# Altium schematic sheet RF.SchDoc
size 393 x 281 mm; DocumentNumber: 5; SheetNumber: 5; SheetTotal: 11
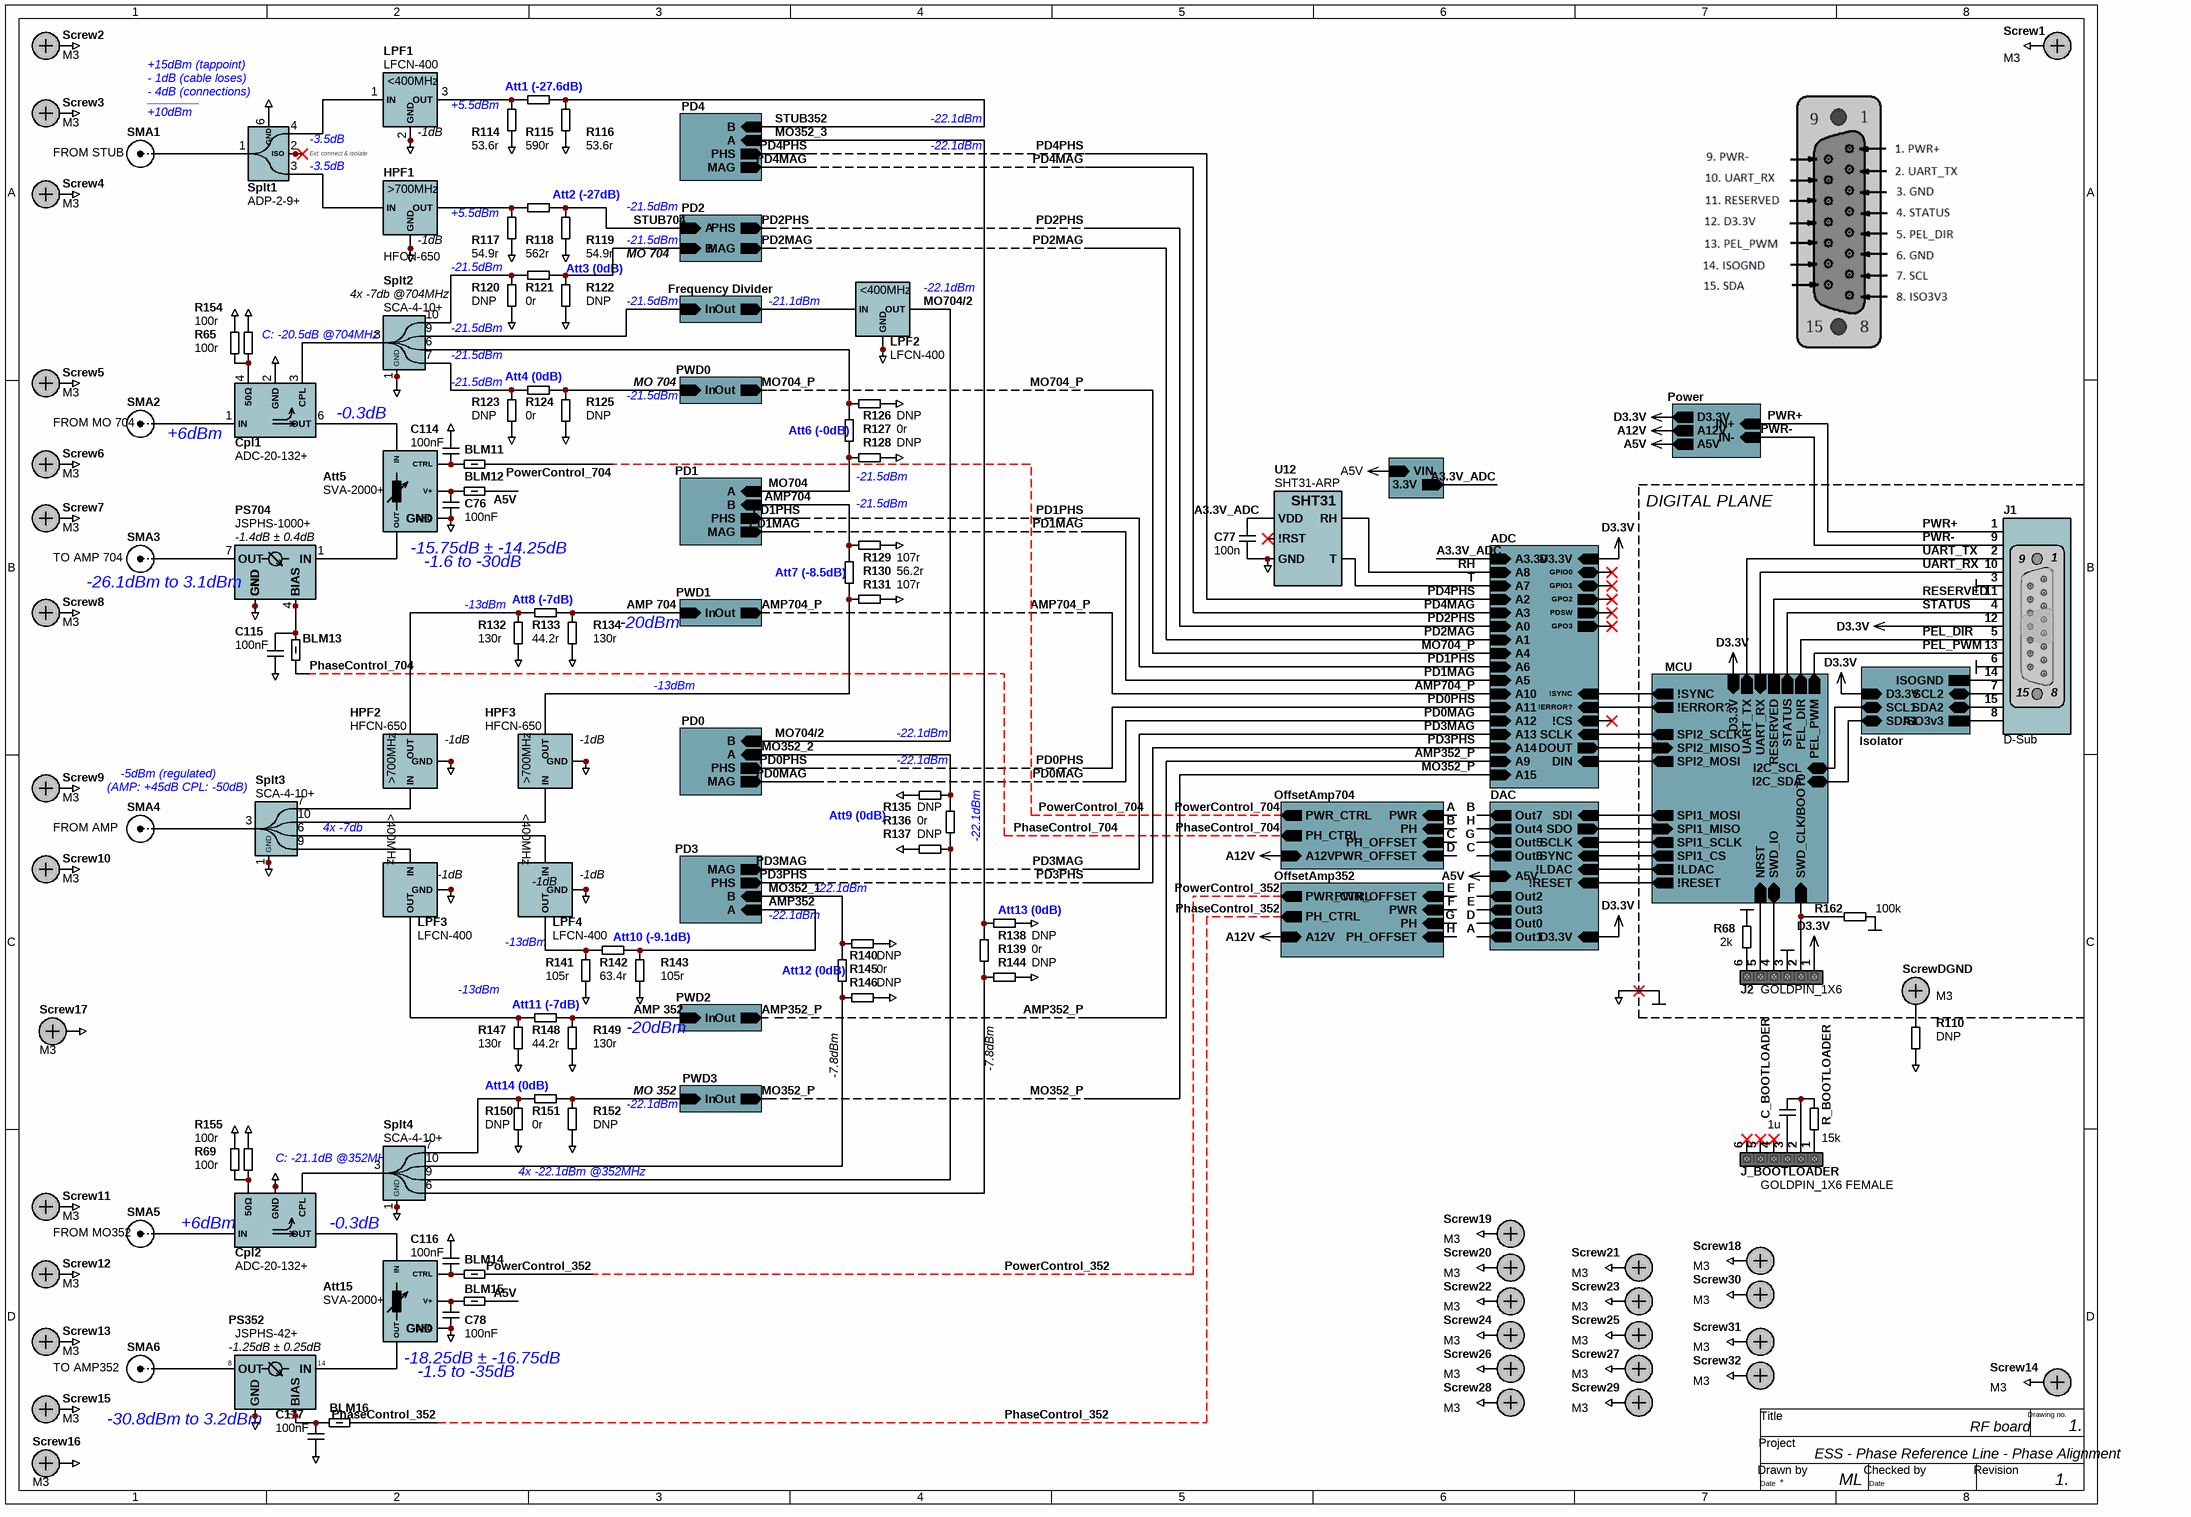
[diagram p0: RF.SchDoc]

## Parts
Att5  SVA-2000+  [FZ990]
Att15  SVA-2000+  [FZ990]
BLM11  120 Ohms @ 100MHz  [0402-Inductor]  (value not drawn)
BLM12  120 Ohms @ 100MHz  [0402-Inductor]  (value not drawn)
BLM13  120 Ohms @ 100MHz  [0402-Inductor]  (value not drawn)
BLM14  120 Ohms @ 100MHz  [0402-Inductor]  (value not drawn)
BLM15  120 Ohms @ 100MHz  [0402-Inductor]  (value not drawn)
BLM16  120 Ohms @ 100MHz  [0402-Inductor]  (value not drawn)
C76  100nF  [0603-Capacitor]
C77  100n  [0402-Capacitor]
C78  100nF  [0603-Capacitor]
C114  100nF  [0603-Capacitor]
C115  100nF  [0603-Capacitor]
C116  100nF  [0603-Capacitor]
C117  100nF  [0603-Capacitor]
C_BOOTLOADER  1u  [0603-Capacitor]  (no BOM)
Cpl1  ADC-20-132+  [CD542]
Cpl2  ADC-20-132+  [CD542]
HPF1  HFCN-650  [FV1206]
HPF2  HFCN-650  [FV1206]
HPF3  HFCN-650  [FV1206]
J1  D-Sub  [AE10105-ND]
J2  GOLDPIN_1X6  [HDR_1x6 SMD]
J_BOOTLOADER  GOLDPIN_1X6 FEMALE  [HDR_1x6 SMD]  (no BOM)
LPF1  LFCN-400  [FV1206]
LPF2  LFCN-400  [FV1206]
LPF3  LFCN-400  [FV1206]
LPF4  LFCN-400  [FV1206]
PS352  JSPHS-42+  [BK276]
PS704  JSPHS-1000+  [BK276]
R65  100r  [0402-RESISTOR]
R68  2k  [0402-RESISTOR]
R69  100r  [0402-RESISTOR]
R110  DNP  [0402-RESISTOR]  (no BOM)
R114  53.6r  [0603-RESISTOR]
R115  590r  [0603-RESISTOR]
R116  53.6r  [0603-RESISTOR]
R117  54.9r  [0603-RESISTOR]
R118  562r  [0603-RESISTOR]
R119  54.9r  [0603-RESISTOR]
R120  DNP  [0603-RESISTOR]  (no BOM)
R121  0r  [0603-RESISTOR]
R122  DNP  [0603-RESISTOR]  (no BOM)
R123  DNP  [0603-RESISTOR]  (no BOM)
R124  0r  [0603-RESISTOR]
R125  DNP  [0603-RESISTOR]  (no BOM)
R126  DNP  [0603-RESISTOR]  (no BOM)
R127  0r  [0603-RESISTOR]
R128  DNP  [0603-RESISTOR]  (no BOM)
R129  107r  [0603-RESISTOR]
R130  56.2r  [0603-RESISTOR]
R131  107r  [0603-RESISTOR]
R132  130r  [0603-RESISTOR]
R133  44.2r  [0603-RESISTOR]
R134  130r  [0603-RESISTOR]
R135  DNP  [0603-RESISTOR]  (no BOM)
R136  0r  [0603-RESISTOR]
R137  DNP  [0603-RESISTOR]  (no BOM)
R138  DNP  [0603-RESISTOR]  (no BOM)
R139  0r  [0603-RESISTOR]
R140  DNP  [0603-RESISTOR]  (no BOM)
R141  105r  [0603-RESISTOR]
R142  63.4r  [0603-RESISTOR]
R143  105r  [0603-RESISTOR]
R144  DNP  [0603-RESISTOR]  (no BOM)
R145  0r  [0603-RESISTOR]
R146  DNP  [0603-RESISTOR]  (no BOM)
R147  130r  [0603-RESISTOR]
R148  44.2r  [0603-RESISTOR]
R149  130r  [0603-RESISTOR]
R150  DNP  [0603-RESISTOR]  (no BOM)
R151  0r  [0603-RESISTOR]
R152  DNP  [0603-RESISTOR]  (no BOM)
R154  100r  [0402-RESISTOR]
R155  100r  [0402-RESISTOR]
R162  100k  [0402-RESISTOR]
R_BOOTLOADER  15k  [0603-RESISTOR]  (no BOM)
Screw1  M3  [M3 Screw]
Screw2  M3  [M3 Screw]
Screw3  M3  [M3 Screw]
Screw4  M3  [M3 Screw]
Screw5  M3  [M3 Screw]
Screw6  M3  [M3 Screw]
Screw7  M3  [M3 Screw]
Screw8  M3  [M3 Screw]
Screw9  M3  [M3 Screw]
Screw10  M3  [M3 Screw]
Screw11  M3  [M3 Screw]
Screw12  M3  [M3 Screw]
Screw13  M3  [M3 Screw]
Screw14  M3  [M3 Screw]
Screw15  M3  [M3 Screw]
Screw16  M3  [M3 Screw]
Screw17  M3  [M3 Screw]
Screw18  M3  [M3 Screw]
Screw19  M3  [M3 Screw]
Screw20  M3  [M3 Screw]
Screw21  M3  [M3 Screw]
Screw22  M3  [M3 Screw]
Screw23  M3  [M3 Screw]
Screw24  M3  [M3 Screw]
Screw25  M3  [M3 Screw]
Screw26  M3  [M3 Screw]
Screw27  M3  [M3 Screw]
Screw28  M3  [M3 Screw]
Screw29  M3  [M3 Screw]
Screw30  M3  [M3 Screw]
Screw31  M3  [M3 Screw]
Screw32  M3  [M3 Screw]
ScrewDGND  M3  [M3 Screw]
SMA1  FROM STUB  [MC000242]
SMA2  FROM MO 704  [MC000242]
SMA3  TO AMP 704  [MC000242]
SMA4  FROM AMP  [MC000242]
SMA5  FROM MO352  [MC000242]
SMA6  TO AMP352  [MC000242]
Splt1  ADP-2-9+  [CD636]
Splt2  SCA-4-10+  [DZ943]
Splt3  SCA-4-10+  [DZ943]
Splt4  SCA-4-10+  [DZ943]
U12  SHT31-ARP  [TDFN-8 SHT3X-ARP]

## Sub-sheets
A3.3V_ADC = LDO3v3.SchDoc: 3.3V (out), VIN (in)
ADC = ADC.SchDoc: A11 (in), A13 (in), A0 (in), A6 (in), A3 (in), A2 (in), A5 (in), A12 (in), A10 (in), A1 (in), A8 (in), A14 (in), A4 (in), A7 (in), A15 (in), A9 (in), SCLK (in), DIN (in), DOUT (out), D3.3V (in), !ERROR? (in), !SYNC (in), A3.3V (in), GPIO0 (bidir), GPIO1 (bidir), GPO2 (out), PDSW (out), GPO3 (out), !CS (in)
DAC = DAC.SchDoc: Out4 (out), Out6 (out), Out2 (out), Out3 (out), Out7 (out), Out1 (out), Out0 (out), Out5 (out), !SYNC (in), SDI (in), SCLK (in), SDO (out), !LDAC (in), D3.3V (in), A5V (in), !RESET (in)
Frequency Divider = FreqDiv.SchDoc: In (in), Out (out)
Isolator = Isolator.SchDoc: SDA2 (bidir), ISO3v3, SCL2 (bidir), ISOGND, SDA1 (bidir), D3.3V (in), SCL1 (bidir)
MCU = MCU.SchDoc: NRST (in), SWD_CLK/BOOT0 (in), SWD_IO (bidir), !ERROR? (out), !SYNC (out), !LDAC (out), I2C_SDA (bidir), PEL_DIR (out), UART_TX (out), I2C_SCL (bidir), STATUS (out), PEL_PWM (out), RESERVED, UART_RX (in), D3.3V (in), SPI1_CS (out), SPI1_MOSI (out), SPI1_SCLK (out), SPI2_MISO (in), SPI2_SCLK (out), SPI2_MOSI (out), SPI1_MISO (in), !RESET (out)
OffsetAmp352 = OffsetAmplifier.SchDoc: PWR_OFFSET (in), PWR (in), PH_OFFSET (in), PH (in), PWR_CTRL (out), PH_CTRL (out), A12V (in)
OffsetAmp704 = OffsetAmplifier.SchDoc: PWR_OFFSET (in), PWR (in), PH_OFFSET (in), PH (in), PWR_CTRL (out), PH_CTRL (out), A12V (in)
PD0 = PhaseDetector.SchDoc: MAG (out), PHS (out), A (in), B (in)
PD1 = PhaseDetector.SchDoc: MAG (out), PHS (out), A (in), B (in)
PD2 = PhaseDetector.SchDoc: MAG (out), PHS (out), A (in), B (in)
PD3 = PhaseDetector.SchDoc: MAG (out), PHS (out), A (in), B (in)
PD4 = PhaseDetector.SchDoc: MAG (out), PHS (out), A (in), B (in)
Power = Power.SchDoc: IN- (in), IN+ (in), D3.3V (out), A12V (out), A5V (out)
PWD0 = PowerDetector.SchDoc: Out (out), In (in)
PWD1 = PowerDetector.SchDoc: Out (out), In (in)
PWD2 = PowerDetector.SchDoc: Out (out), In (in)
PWD3 = PowerDetector.SchDoc: In (in), Out (out)

## Nets
A5V: BLM12.2 BLM15.2 ; sheet DAC/A5V, sheet Power/A5V, sheet A3.3V_ADC/VIN
A12V: sheet Power/A12V, sheet OffsetAmp704/A12V, sheet OffsetAmp352/A12V
D3.3V: J1.12 J2.1 ; sheet DAC/D3.3V, sheet ADC/D3.3V, sheet Power/D3.3V, sheet MCU/D3.3V, sheet Isolator/D3.3V
DGND: Att5.2(GND) Att5.3(GND) Att5.5(GND) Att5.6(GND) Att5.7(GND) Att5.9(GND) Att5.10(GND) Att5.12(GND) Att15.2(GND) Att15.3(GND) Att15.5(GND) Att15.6(GND) Att15.7(GND) Att15.9(GND) Att15.10(GND) Att15.12(GND) C76.2 C77.1 C78.2 C114.1 C115.2 C116.1 C117.2 Cpl1.2(GND) Cpl2.2(GND) HPF1.2(GND) HPF1.4(GND) HPF2.2(GND) HPF2.4(GND) HPF3.2(GND) HPF3.4(GND) J1.3 J1.6 J2.3 LPF1.2(GND) LPF1.4(GND) LPF2.2(GND) LPF2.4(GND) LPF3.2(GND) LPF3.4(GND) LPF4.2(GND) LPF4.4(GND) PS352.2(GND) PS352.3(GND) PS352.4(GND) PS352.5(GND) PS352.6(GND) PS352.9(GND) PS352.10(GND) PS352.11(GND) PS352.12(GND) PS352.13(GND) PS704.2(GND) PS704.3(GND) PS704.5(GND) PS704.8(GND) PS704.9(GND) PS704.10(GND) PS704.11(GND) PS704.12(GND) PS704.13(GND) PS704.14(GND) R65.2 R68.1 R69.2 R110.2 R114.1 R116.1 R117.1 R119.1 R120.1 R122.1 R123.1 R125.1 R126.1 R128.1 R129.1 R131.1 R132.1 R134.1 R135.1 R137.1 R138.1 R140.1 R141.1 R143.1 R144.1 R146.1 R147.1 R149.1 R150.1 R152.1 R154.2 R155.2 R162.1 Screw1.0 Screw2.0 Screw3.0 Screw4.0 Screw5.0 Screw6.0 Screw7.0 Screw8.0 Screw9.0 Screw10.0 Screw11.0 Screw12.0 Screw13.0 Screw14.0 Screw15.0 Screw16.0 Screw17.0 Screw18.0 Screw19.0 Screw20.0 Screw21.0 Screw22.0 Screw23.0 Screw24.0 Screw25.0 Screw26.0 Screw27.0 Screw28.0 Screw29.0 Screw30.0 Screw31.0 Screw32.0 Splt1.6(GND) Splt2.1(GND) Splt2.2(GND) Splt2.4(GND) Splt2.5(GND) Splt2.8(GND) Splt3.1(GND) Splt3.2(GND) Splt3.4(GND) Splt3.5(GND) Splt3.8(GND) Splt4.1(GND) Splt4.2(GND) Splt4.4(GND) Splt4.5(GND) Splt4.8(GND) U12.2(GND) U12.3(GND) U12.7(GND) U12.8(GND) U12.EP  [also labelled GND]
A: sheet DAC/Out1, sheet OffsetAmp704/PWR
A3.3V_ADC: C77.2 U12.5(VDD) ; sheet ADC/A3.3V, sheet A3.3V_ADC/3.3V
AMP352: R142.2 R143.2 ; sheet PD3/A
AMP352_P: sheet ADC/A9, sheet PWD2/Out
AMP704: R129.2 R130.2 ; sheet PD1/B
AMP704_P: sheet ADC/A10, sheet PWD1/Out
B: sheet DAC/Out7, sheet OffsetAmp704/PH
C: sheet DAC/Out6, sheet OffsetAmp704/PH_OFFSET
D: sheet DAC/Out0, sheet OffsetAmp704/PWR_OFFSET
E: sheet DAC/Out3, sheet OffsetAmp352/PWR_OFFSET
F: sheet DAC/Out2, sheet OffsetAmp352/PWR
G: sheet DAC/Out5, sheet OffsetAmp352/PH
H: sheet DAC/Out4, sheet OffsetAmp352/PH_OFFSET
MO352_1: R140.2 R145.2 ; sheet PD3/B
MO352_2: R135.2 R136.2 ; sheet PD0/A
MO352_3: R138.2 R139.2 ; sheet PD4/A
MO352_P: sheet ADC/A15, sheet PWD3/Out
MO704: R127.1 R128.2 ; sheet PD1/A
MO704/2: LPF2.3(OUT) ; sheet PD0/B
MO704_P: sheet ADC/A4, sheet PWD0/Out
PD0MAG: sheet PD0/MAG, sheet ADC/A12
PD0PHS: sheet PD0/PHS, sheet ADC/A11
PD1MAG: sheet PD1/MAG, sheet ADC/A5
PD1PHS: sheet PD1/PHS, sheet ADC/A6
PD2MAG: sheet PD2/MAG, sheet ADC/A1
PD2PHS: sheet PD2/PHS, sheet ADC/A0
PD3MAG: sheet PD3/MAG, sheet ADC/A13
PD3PHS: sheet PD3/PHS, sheet ADC/A14
PD4MAG: sheet PD4/MAG, sheet ADC/A3
PD4PHS: sheet PD4/PHS, sheet ADC/A2
PEL_DIR: J1.5 ; sheet MCU/PEL_DIR
PEL_PWM: J1.13 ; sheet MCU/PEL_PWM
PhaseControl_352: BLM16.2 ; sheet OffsetAmp352/PH_CTRL
PhaseControl_704: BLM13.1 ; sheet OffsetAmp704/PH_CTRL
PowerControl_352: BLM14.2 ; sheet OffsetAmp352/PWR_CTRL
PowerControl_704: BLM11.1 ; sheet OffsetAmp704/PWR_CTRL
PWR+: J1.1 ; sheet Power/IN+
PWR-: J1.9 ; sheet Power/IN-
RESERVED: J1.11 ; sheet MCU/RESERVED
RH: U12.1(RH) ; sheet ADC/A8
STATUS: J1.4 ; sheet MCU/STATUS
STUB352: R115.2 R116.2 ; sheet PD4/B
STUB704: R118.2 R119.2 ; sheet PD2/A
T: U12.4(T) ; sheet ADC/A7
UART_RX: J1.10 ; sheet MCU/UART_RX
UART_TX: J1.2 ; sheet MCU/UART_TX
NetAtt5_1: Att5.1(OUT) PS704.1(IN)
NetAtt5_4: Att5.4(CTRL) BLM11.2 C114.2
NetAtt5_8: Att5.8(IN) Cpl1.6(OUT)
NetAtt5_11: Att5.11(V+) BLM12.1 C76.1
NetAtt15_1: Att15.1(OUT) PS352.14(IN)
NetAtt15_4: Att15.4(CTRL) BLM14.1 C116.2
NetAtt15_8: Att15.8(IN) Cpl2.6(OUT)
NetAtt15_11: Att15.11(V+) BLM15.1 C78.1
NetBLM13_2: BLM13.2 C115.1 PS704.4(BIAS) PS704.6(BIAS)
NetBLM16_1: BLM16.1 C117.1 PS352.1(BIAS) PS352.7(BIAS)
NetC_BOOTLOADER_1: C_BOOTLOADER.1 J_BOOTLOADER.3
NetC_BOOTLOADER_2: C_BOOTLOADER.2 J_BOOTLOADER.2 R_BOOTLOADER.2
NetCpl1_1: Cpl1.1(IN) SMA2.0(RF)
NetCpl1_3: Cpl1.3(CPL) Splt2.3(S)
NetCpl1_4: Cpl1.4(50Ω) R65.1 R154.1
NetCpl2_1: Cpl2.1(IN) SMA5.0(RF)
NetCpl2_3: Cpl2.3(CPL) Splt4.3(S)
NetCpl2_4: Cpl2.4(50Ω) R69.1 R155.1
NetHPF1_1: HPF1.1(IN) Splt1.3(P1)
NetHPF1_3: HPF1.3(OUT) R117.2 R118.1
NetHPF2_1: HPF2.1(IN) Splt3.7(P2)
NetHPF2_3: HPF2.3(OUT) R132.2 R133.1
NetHPF3_1: HPF3.1(IN) Splt3.10(P4)
NetHPF3_3: HPF3.3(OUT) R130.1 R131.2
NetJ1_7: J1.7 ; sheet Isolator/SCL2
NetJ1_8: J1.8 ; sheet Isolator/ISO3v3
NetJ1_14: J1.14 ; sheet Isolator/ISOGND
NetJ1_15: J1.15 ; sheet Isolator/SDA2
NetJ2_2: J2.2 R162.2 ; sheet MCU/SWD_CLK/BOOT0
NetJ2_4: J2.4 ; sheet MCU/SWD_IO
NetJ2_5: J2.5 ; sheet MCU/NRST
NetJ2_6: J2.6 R68.2
NetJ_BOOTLOADER_1: J_BOOTLOADER.1 R_BOOTLOADER.1
NetLPF1_1: LPF1.1(IN) Splt1.4(P2)
NetLPF1_3: LPF1.3(OUT) R114.2 R115.1
NetLPF2_1: LPF2.1(IN) ; sheet Frequency Divider/Out
NetLPF3_1: LPF3.1(IN) Splt3.9(P3)
NetLPF3_3: LPF3.3(OUT) R147.2 R148.1
NetLPF4_1: LPF4.1(IN) Splt3.6(P1)
NetLPF4_3: LPF4.3(OUT) R141.2 R142.1
NetPS352_8: PS352.8(OUT) SMA6.0(RF)
NetPS704_7: PS704.7(OUT) SMA3.0(RF)
NetR110_1: R110.1 ScrewDGND.0
NetR120_2: R120.2 R121.1 Splt2.10(P4)
NetR121_2: R121.2 R122.2 ; sheet PD2/B
NetR123_2: R123.2 R124.1 Splt2.7(P2)
NetR124_2: R124.2 R125.2 ; sheet PWD0/In
NetR126_2: R126.2 R127.2 Splt2.6(P1)
NetR133_2: R133.2 R134.2 ; sheet PWD1/In
NetR136_1: R136.1 R137.2 Splt4.9(P3)
NetR139_1: R139.1 R144.2 Splt4.6(P1)
NetR145_1: R145.1 R146.2 Splt4.10(P4)
NetR148_2: R148.2 R149.2 ; sheet PWD2/In
NetR150_2: R150.2 R151.1 Splt4.7(P2)
NetR151_2: R151.2 R152.2 ; sheet PWD3/In
NetSMA1_0: SMA1.0(RF) Splt1.1(SUM)
NetSMA4_0: SMA4.0(RF) Splt3.3(S)
NetSplt1_2: Splt1.2(ISO) Splt1.5(ISO)
NetSplt2_9: Splt2.9(P3) ; sheet Frequency Divider/In
(unnamed): sheet DAC/!SYNC, sheet MCU/SPI1_CS
(unnamed): sheet DAC/SDI, sheet MCU/SPI1_MOSI
(unnamed): sheet DAC/SCLK, sheet MCU/SPI1_SCLK
(unnamed): sheet DAC/SDO, sheet MCU/SPI1_MISO
(unnamed): sheet DAC/!LDAC, sheet MCU/!LDAC
(unnamed): sheet DAC/!RESET, sheet MCU/!RESET
(unnamed): sheet ADC/SCLK, sheet MCU/SPI2_SCLK
(unnamed): sheet ADC/DIN, sheet MCU/SPI2_MOSI
(unnamed): sheet ADC/DOUT, sheet MCU/SPI2_MISO
(unnamed): sheet ADC/!ERROR?, sheet MCU/!ERROR?
(unnamed): sheet ADC/!SYNC, sheet MCU/!SYNC
(unnamed): sheet MCU/I2C_SDA, sheet Isolator/SDA1
(unnamed): sheet MCU/I2C_SCL, sheet Isolator/SCL1

Not connected (* = marked no-connect by the designer): Cpl1 5(ISOL); Cpl2 5(ISOL); J_BOOTLOADER 4* 5* 6*; U12 6(!RST)*

## Notes on the sheet
- +15dBm (tappoint)
- (near Splt1) - 1dB (cable loses)
- (near Splt1) - 4dB (connections)
- ________
- +5.5dBm
- (near R115) Att1 (-27.6dB)
- (near SMA1) +10dBm
- (near Splt1) -3.5dB
- Ext. connect & isolate
- (near LPF1) -1dB
- -22.1dBm
- (near HPF1) -1dB
- (near R118) Att2 (-27dB)
- -21.5dBm
- (near Splt2) 4x -7db @704MHz
- Att3 (0dB)
- MO 704
- (near LPF2) -21.1dBm
- (near LPF2) -22.1dBm
- C: -20.5dB @704MHz
- (near R124) Att4 (0dB)
- (near SMA2) +6dBm
- -0.3dB
- (near R123) -21.5dBm
- (near R127) Att6 (-0dB)
- (near R128) -21.5dBm
- DIGITAL PLANE
- (near PS704) -26.1dBm to 3.1dBm
- (near PS704) -1.4dB ± 0.4dB
- (near Att5) -15.75dB ± -14.25dB
- (near Att5) -1.6 to -30dB
- (near R130) Att7 (-8.5dB)
- -13dBm
- (near R133) Att8 (-7dB)
- -20dBm
- AMP 704
- -5dBm (regulated)
- (near HPF2) -1dB
- (near HPF3) -1dB
- (near Splt3) (AMP: +45dB CPL: -50dB)
- (near Splt3) 4x -7db
- Att9 (0dB)
- PowerControl_704
- PhaseControl_704
- (near LPF3) -1dB
- (near LPF4) -1dB
- (near R138) Att13 (0dB)
- (near LPF4) -13dBm
- (near R142) Att10 (-9.1dB)
- (near R145) Att12 (0dB)
- (near R148) Att11 (-7dB)
- (near R143) AMP 352
- (near R151) Att14 (0dB)
- MO 352
- -17.8dBm
- -7.8dBm
- (near Splt4) C: -21.1dB @352MHz
- 4x -22.1dBm @352MHz
- (near Cpl2) +6dBm
- PowerControl_352
- (near PS352) -1.25dB ± 0.25dB
- (near Att15) -18.25dB ± -16.75dB
- (near Att15) -1.5 to -35dB
- (near PS352) -30.8dBm to 3.2dBm
- PhaseControl_352
- ESS - Phase Reference Line - Phase Alignment
- (near Screw14) RF board
- (near Screw14) 1.
- ML
- 1.
- Title
- Project
- Drawing no.
- Date
- Drawn by
- Checked by
- Revision
- (in symbol HFCN-650) >700MHz
- (in symbol LFCN-400) <400MHz

## Library data of the parts
Att5 Att15 = SVA-2000+: Voltage Variable Attenuator / 50Ω 50 to 2000 MHz; Case: FZ990; HelpURL: https://www.minicircuits.com/pdfs/SVA-2000+.pdf; Supplier Part Number 1: SVA-2000+; Supplier 1: Mini-Circuits
BLM11-BLM16 = BLM15AX121SZ1D: 120 Ohms @ 100MHz 1 Power, Signal Line Ferrite Bead 0402 (1005 Metric) 700mA 130mOhm; Case: 0402; Supplier 1: Digi-Key; Supplier Part Number 1: 490-16510-1-ND; HelpURL: https://www.murata.com/en-us/products/productdata/8796748677150/QNFA9118.pdf
C76 C78 C114-C117 = C_0603: Capacitor 0603; Tolerance: ±20%; Voltage Rating: 16V; Dielectric: X7R/C0G; Value: 100nF; Case: 0603
C77 = C_0402: Capacitor 0402; Tolerance: ±20%; Voltage Rating: 16V; Dielectric: X7R/C0G; Value: 100n; Case: 0402
C_BOOTLOADER = C_0603: Capacitor 0603; Dielectric: X7R/C0G; Voltage Rating: 16V; Tolerance: ±20%; Value: 1u; Case: 0603
Cpl1 Cpl2 = ADC-20-132+: 20 dB SMT Directional Coupler, 100 - 1300 MHz, 50Ω; HelpURL: https://www.minicircuits.com/pdfs/ADC-20-132+.pdf; Supplier 1: Mini-Circuits; Supplier Part Number 1: ADC-20-132+; Case: CD542
HPF1-HPF3 = HFCN-650: Ceramic High Pass Filter / • 50Ω / • 710 to 2490 MHz; HelpURL: https://www.minicircuits.com/pdfs/HFCN-650.pdf; Supplier 1: Mini-Circuits; Supplier Part Number 1: HFCN-650; Case: FV1206
J1 = A-DF 15 AA-WP: 15 Position D-Sub Plug, Female Pins Connector; HelpURL: http://www.assmann-wsw.com/fileadmin/datasheets/ASS_3251_CO.pdf; Supplier 1: Digi-Key; Supplier Part Number 1: AE10105-ND
J_BOOTLOADER = GOLDPIN_1X6: HelpURL: https://www.metz-connect.com/us/system/files/productfiles/Data_sheet_PM202XXVBNN.PDF; Supplier 1: Digi-Key; Supplier Part Number 1: 1849-1036-ND
LPF1-LPF4 = LFCN-400: Ceramic Low Pass Filter / • 50Ω / • DC to 400 MHz; HelpURL: https://ww2.minicircuits.com/pdfs/LFCN-400.pdf; Supplier 1: Mini-Circuits; Supplier Part Number 1: LFCN-400; Case: FV1206
PS352 = JSPHS-42+: Narrow Band Phase Shifter / • 50 Ohm / • 180 deg Voltage Variable / • 300 MHz to 400 MHz /; HelpURL: https://ww2.minicircuits.com/pdfs/JSPHS-42+.pdf; Supplier 1: Mini-Circuits; Supplier Part Number 1: JSPHS-42+; Case: BK276
PS704 = JSPHS-1000+: Narrow Band Phase Shifter / • 50 Ohm / • 180 deg Voltage Variable / • 700 MHz to 1000 MHz /; HelpURL: https://ww2.minicircuits.com/pdfs/JSPHS-1000+.pdf; Supplier 1: Mini-Circuits; Supplier Part Number 1: JSPHS-1000+; Case: BK276
R65 R68 R69 R154 R155 R162 = R_0402: Resistor 0402; Tolerance: ±1%; Case: 0402
  R65 R69 R154 R155: Value: 100r
  R68: Value: 2k
  R162: Value: 100k
R110 = R_0402: Resistor 0402; Value: 0r; Tolerance: ±1%; Case: 0402
R114-R119 R121 R124 R127 R129-R134 R136 R139 R141-R143 R145 R147-R149 R151 = R_0603: Resistor 0603; Tolerance: ±1%; Case: 0603
  R114 R116: Value: 53.6r
  R115: Value: 590r
  R117 R119: Value: 54.9r
  R118: Value: 562r
  R121 R124 R127 R136 R139 R145 R151: Value: 0r
  R129 R131: Value: 107r
  R130: Value: 56.2r
  R132 R134 R147 R149: Value: 130r
  R133 R148: Value: 44.2r
  R141 R143: Value: 105r
  R142: Value: 63.4r
R120 R122 R123 R125 R126 R128 R135 R137 R138 R140 R146 R150 R152 = R_0603: Resistor 0603; Value: 50r; Tolerance: ±1%; Case: 0603
R144 = R_0603: Resistor 0603; Value: 392r; Tolerance: ±1%; Case: 0603
R_BOOTLOADER = R_0603: Resistor 0603; Value: 15k; Case: 0603
Screw1-Screw32 ScrewDGND = M3 Screw
SMA1-SMA6 = MC000242: SMA Bulkhead Jack / Front Mount; HelpURL: http://www.farnell.com/datasheets/1686097.pdf?_ga=2.110163462.2015351761.1577118285-755396856.1571840580; Supplier 1: Farnell; Supplier Part Number 1: 2253765
Splt1 = ADP-2-9+: Power Splitter/Combiner / • 2 Way-0° / • 50Ω / • 200 to 900 MHz; HelpURL: https://ww2.minicircuits.com/pdfs/ADP-2-9+.pdf; Supplier 1: Mini-Circuits; Supplier Part Number 1: ADP-2-9+; Case: CD636
Splt2-Splt4 = SCA-4-10+: Power Splitter/Combiner / • 4 Way / • 50Ω / • 5 to 1000 MHz; HelpURL: https://www.minicircuits.com/pdfs/SCA-4-10+.pdf; Supplier 1: Mini-Circuits; Supplier Part Number 1: SCA-4-10+; Case: DZ943
U12 = SHT31: Humidity and Temperature Sensor IC; HelpURL: https://media.digikey.com/pdf/Data%20Sheets/Sensirion%20PDFs/HT_DS_SHT3x_ARP_V3.pdf; Case: 8-DFN; Supplier 1: Digi-Key; Supplier Part Number 1: 1649-1012-1-ND
J2 = GOLDPIN_1X6: HelpURL: https://www.metz-connect.com/us/system/files/productfiles/Data_sheet_PM202XXVBNN.PDF; Supplier 1: Digi-Key; Supplier Part Number 1: 1849-1036-ND